# Altium schematic sheet T.SchDoc
size A4
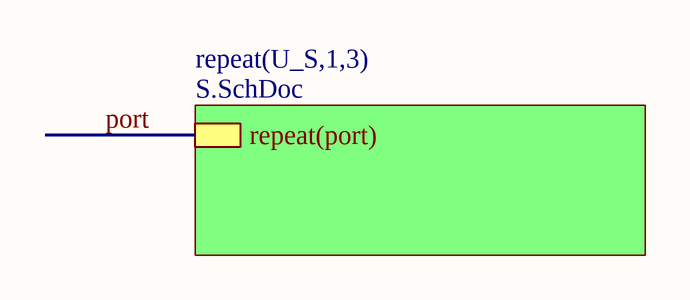
[diagram p0: T.SchDoc]

## Sub-sheets
repeat(U_S,1,3) = S.SchDoc: repeat(port)

## Nets
port: sheet repeat(U_S,1,3)/repeat(port)